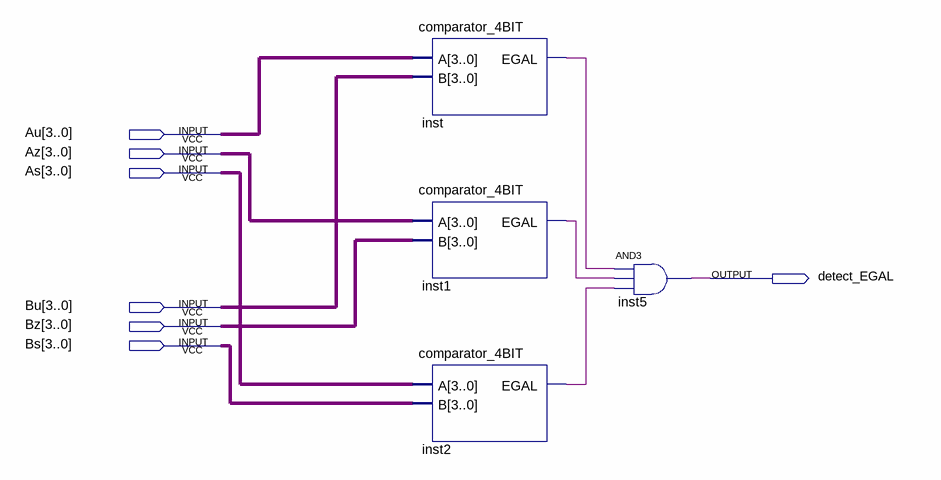
[diagram p0: schematic sheet]
// Quartus schematic comparator_12BIT.bdf as structural Verilog: 4 symbols, 7 pins
module comparator_12BIT (
  input  [3:0] Au,
  input  [3:0] Az,
  input  [3:0] As,
  input  [3:0] Bu,
  input  [3:0] Bz,
  input  [3:0] Bs,
  output detect_EGAL
);

  wire inst1_egal, inst2_egal, inst_egal;

  comparator_4BIT inst (.A(Au), .B(Bu), .EGAL(inst_egal));
  comparator_4BIT inst1 (.A(Az), .B(Bz), .EGAL(inst1_egal));
  comparator_4BIT inst2 (.A(As), .B(Bs), .EGAL(inst2_egal));
  and inst5 (detect_EGAL, inst_egal, inst1_egal, inst2_egal);
endmodule
